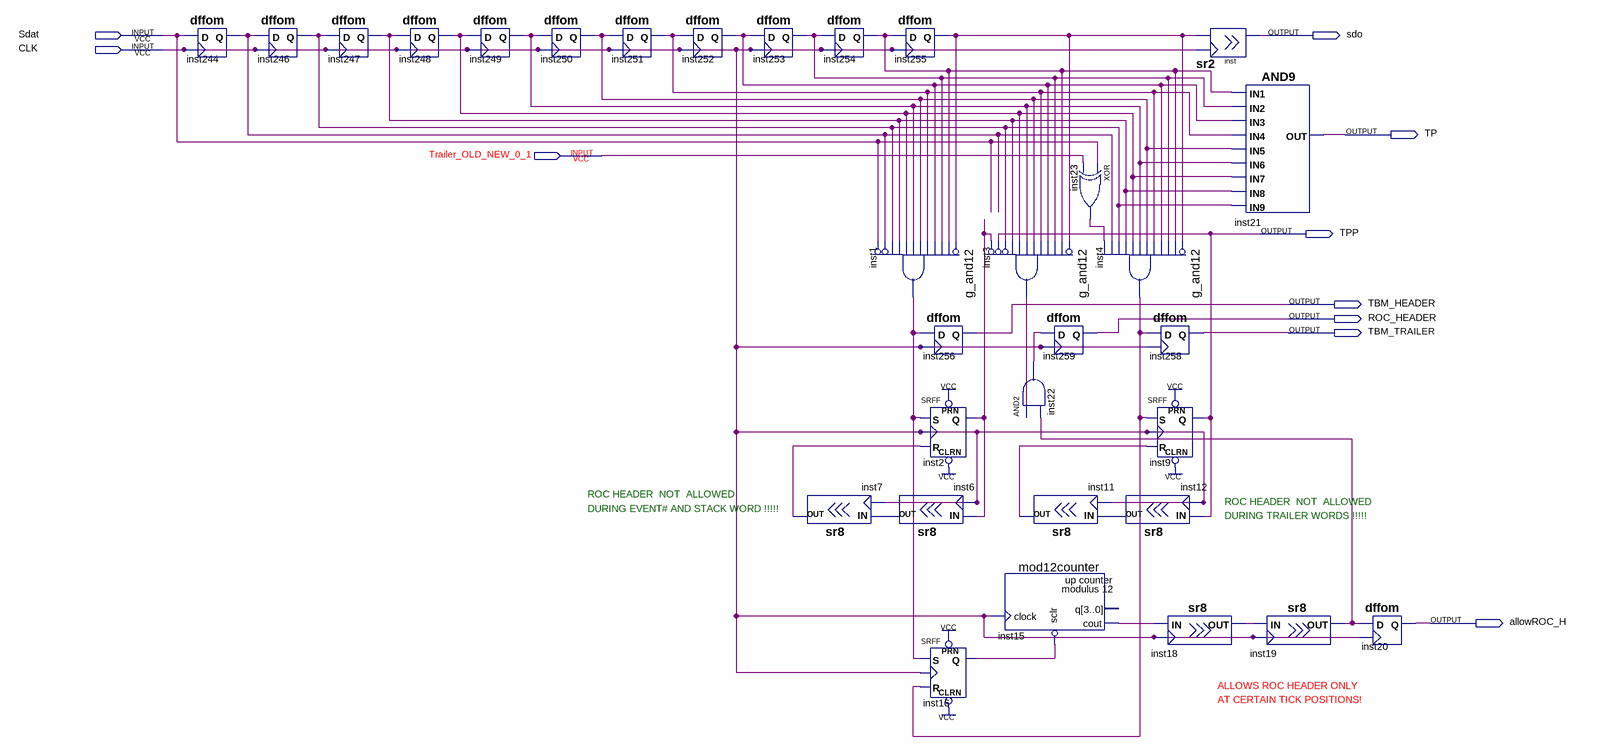
[diagram p0: schematic sheet]
// Quartus schematic HeaderTrailer.bdf as structural Verilog: 32 symbols, 10 pins
module HeaderTrailer (
  input  Sdat,
  input  CLK,
  input  Trailer_OLD_NEW_0_1,
  output sdo,
  output TP,
  output TPP,
  output TBM_HEADER,
  output ROC_HEADER,
  output TBM_TRAILER,
  output allowROC_H
);

  wire inst1_result, inst2_q, inst3_result, inst4_result, inst6_out, inst7_out, inst11_out, inst12_out,
       inst15_cout, inst16_q, inst18_out, inst19_out, inst22_out, inst23_out, inst244_q, inst246_q,
       inst247_q, inst248_q, inst249_q, inst250_q, inst251_q, inst252_q, inst253_q, inst254_q, inst255_q;

  dffom inst244 (.D(Sdat), .CK(CLK), .Q(inst244_q));
  dffom inst246 (.D(inst244_q), .CK(CLK), .Q(inst246_q));
  dffom inst247 (.D(inst246_q), .CK(CLK), .Q(inst247_q));
  dffom inst248 (.D(inst247_q), .CK(CLK), .Q(inst248_q));
  dffom inst249 (.D(inst248_q), .CK(CLK), .Q(inst249_q));
  dffom inst250 (.D(inst249_q), .CK(CLK), .Q(inst250_q));
  dffom inst251 (.D(inst250_q), .CK(CLK), .Q(inst251_q));
  dffom inst252 (.D(inst251_q), .CK(CLK), .Q(inst252_q));
  dffom inst253 (.D(inst252_q), .CK(CLK), .Q(inst253_q));
  sr8 inst7 (.IN(inst6_out), .CLK(CLK), .OUT(inst7_out));
  dffom inst254 (.D(inst253_q), .CK(CLK), .Q(inst254_q));
  dffom inst255 (.D(inst254_q), .CK(CLK), .Q(inst255_q));
  g_and12 inst1 (
    .data0(~inst255_q), .data1(inst254_q), .data2(inst253_q), .data3(inst252_q), .data4(inst251_q),
    .data5(inst250_q), .data6(inst249_q), .data7(inst248_q), .data8(inst247_q), .data9(inst246_q),
    .data10(~inst244_q), .data11(~Sdat), .result(inst1_result));
  sr8 inst6 (.IN(inst2_q), .CLK(CLK), .OUT(inst6_out));
  dffom inst256 (.D(inst1_result), .CK(CLK), .Q(TBM_HEADER));
  SRFF inst2 (.PRN(1'b1), .CLRN(1'b1), .S(inst1_result), .R(inst7_out), .CLK(CLK), .Q(inst2_q));
  SRFF inst16 (.PRN(1'b1), .CLRN(1'b1), .S(inst1_result), .R(inst4_result), .CLK(CLK), .Q(inst16_q));
  g_and12 inst3 (
    .data0(~inst255_q), .data1(inst254_q), .data2(inst253_q), .data3(inst252_q), .data4(inst251_q),
    .data5(inst250_q), .data6(inst249_q), .data7(inst248_q), .data8(inst247_q), .data9(~inst246_q),
    .data10(~TPP), .data11(~inst2_q), .result(inst3_result));
  and inst22 (inst22_out, inst3_result, inst19_out);
  sr8 inst11 (.IN(inst12_out), .CLK(CLK), .OUT(inst11_out));
  mod12counter inst15 (.sclr(~inst16_q), .clock(CLK), .cout(inst15_cout));  // open: q
  xor inst23 (inst23_out, Sdat, Trailer_OLD_NEW_0_1);
  dffom inst259 (.D(inst22_out), .CK(CLK), .Q(ROC_HEADER));
  g_and12 inst4 (
    .data0(~inst255_q), .data1(inst254_q), .data2(inst253_q), .data3(inst252_q), .data4(inst251_q),
    .data5(inst250_q), .data6(inst249_q), .data7(inst248_q), .data8(inst247_q), .data9(inst246_q),
    .data10(inst244_q), .data11(inst23_out), .result(inst4_result));
  sr8 inst12 (.IN(TPP), .CLK(CLK), .OUT(inst12_out));
  dffom inst258 (.D(inst4_result), .CK(CLK), .Q(TBM_TRAILER));
  SRFF inst9 (.PRN(1'b1), .CLRN(1'b1), .S(inst4_result), .R(inst11_out), .CLK(CLK), .Q(TPP));
  sr8 inst18 (.IN(inst15_cout), .CLK(CLK), .OUT(inst18_out));
  sr2 inst (.CLK(CLK), .IN(inst255_q), .OUT(sdo));
  and inst21 (TP, inst254_q, inst253_q, inst252_q, inst251_q, inst250_q, inst249_q, inst248_q, inst247_q, inst246_q);
  sr8 inst19 (.IN(inst18_out), .CLK(CLK), .OUT(inst19_out));
  dffom inst20 (.D(inst19_out), .CK(CLK), .Q(allowROC_H));

  // Notes on the sheet:
  //   ROC HEADER  NOT  ALLOWED
  //   ROC HEADER  NOT  ALLOWED
  //   DURING EVENT# AND STACK WORD !!!!!
  //   DURING TRAILER WORDS !!!!!
  //   ALLOWS ROC HEADER ONLY
  //   AT CERTAIN TICK POSITIONS!
endmodule
